# Altium schematic sheet FPGA_Bank_2.SchDoc
size A3
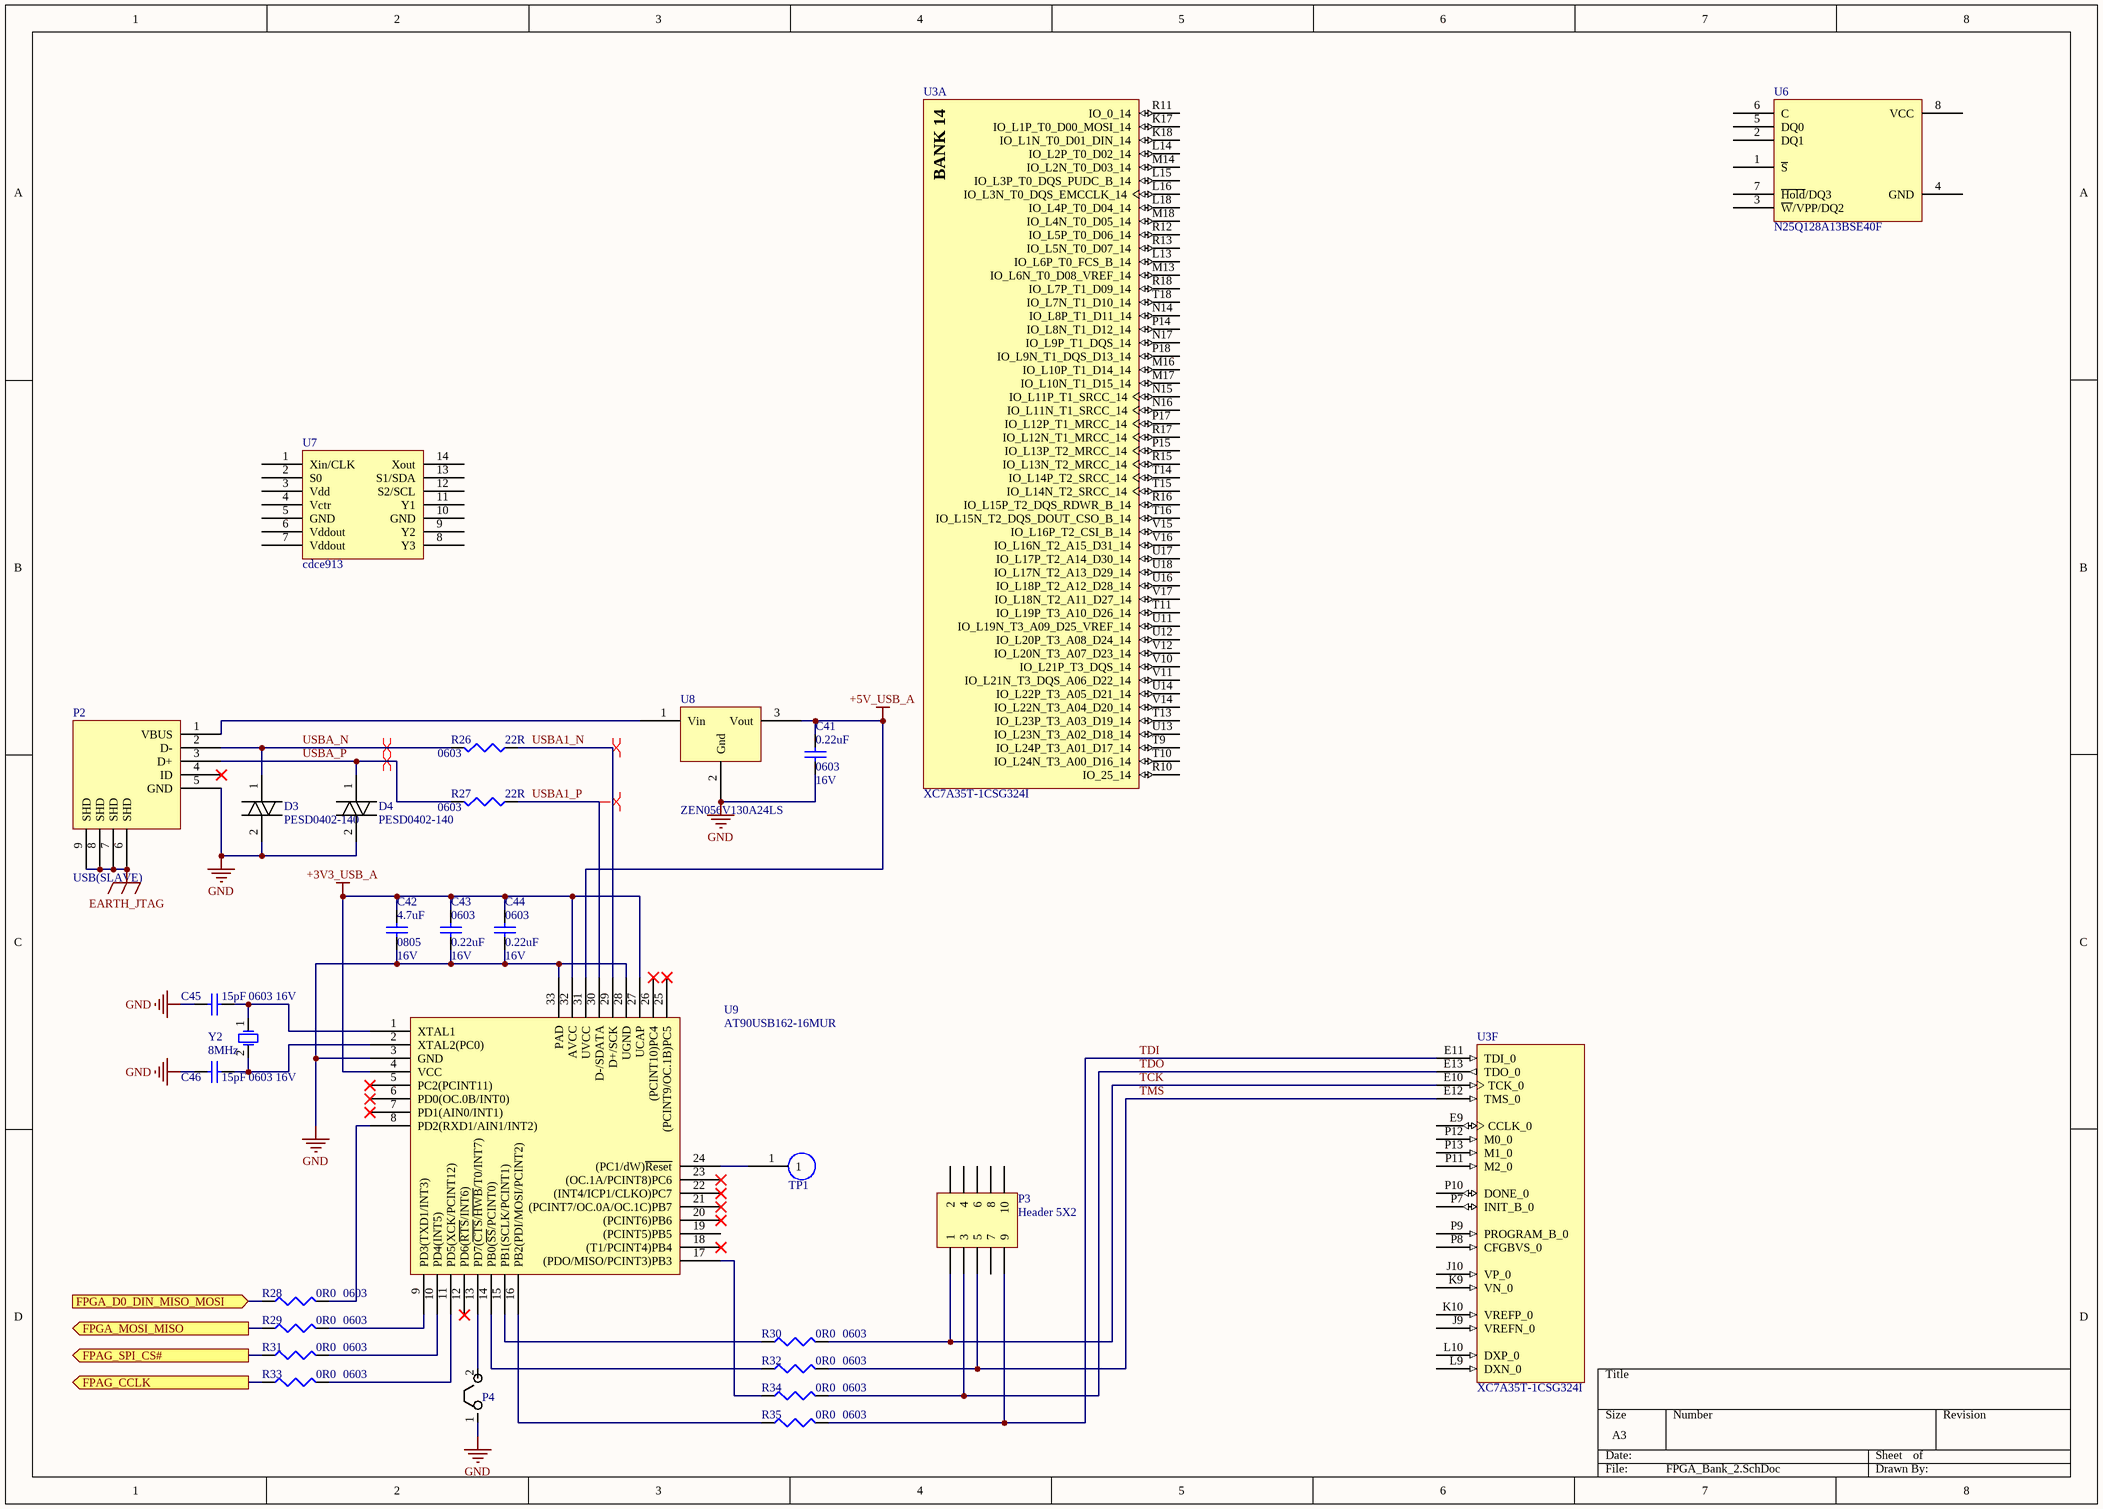
[diagram p0: FPGA_Bank_2.SchDoc]

## Parts
C41  PackageReference: 0603  V: 16V  [1608[0603]]  (hidden comment: 0.22uF)
C42  PackageReference: 0805  V: 16V  [2012[0805]]  (hidden comment: 4.7uF)
C43  PackageReference: 0603  V: 16V  [1608[0603]]  (hidden comment: 0.22uF)
C44  PackageReference: 0603  V: 16V  [1608[0603]]  (hidden comment: 0.22uF)
C45  PackageReference: 0603  V: 16V  [1608[0603]]  (hidden comment: 15pF)
C46  PackageReference: 0603  V: 16V  [1608[0603]]  (hidden comment: 15pF)
D3  PESD0402-140  [PESD0402-140]
D4  PESD0402-140  [PESD0402-140]
P2  USB(SLAVE)  [USB_MINI_Btype]
P3  Header 5X2  [HDR2X5]
P4  DNP  [DNP]  (value not drawn)
R26  value 22R  PackageReference: 0603  [1608[0603]]  (hidden comment: Res3)
R27  value 22R  PackageReference: 0603  [1608[0603]]  (hidden comment: Res3)
R28  value 0R0  PackageReference: 0603  [1608[0603]]  (hidden comment: Res3)
R29  value 0R0  PackageReference: 0603  [1608[0603]]  (hidden comment: Res3)
R30  value 0R0  PackageReference: 0603  [1608[0603]]  (hidden comment: Res3)
R31  value 0R0  PackageReference: 0603  [1608[0603]]  (hidden comment: Res3)
R32  value 0R0  PackageReference: 0603  [1608[0603]]  (hidden comment: Res3)
R33  value 0R0  PackageReference: 0603  [1608[0603]]  (hidden comment: Res3)
R34  value 0R0  PackageReference: 0603  [1608[0603]]  (hidden comment: Res3)
R35  value 0R0  PackageReference: 0603  [1608[0603]]  (hidden comment: Res3)
TP1  TP  (value not drawn)
U3  XC7A35T-1CSG324I  [CSG324]  (parts A,F of 9)
U6  N25Q128A13BSE40F  [N25Q128A13BSE40F[SOP-8]]
U7  cdce913  [CDCE913[TSSOP-14]]
U8  ZEN056V130A24LS  [ZEN056]
U9  AT90USB162-16MUR  [AT90USB162-16MUR]
Y2  8MHz  [XTAL_A]

## Ports
FPAG_CCLK (out), FPAG_SPI_CS# (out), FPGA_D0_DIN_MISO_MOSI (in), FPGA_MOSI_MISO (out)

## Nets
+3V3_USB_A: C42.1 C43.1 C44.1 U9.4(VCC) U9.27(UCAP) U9.32(AVCC)
+5V_USB_A: C41.1 U8.3(Vout) U9.31(UVCC)
EARTH_JTAG: P2.6(SHD) P2.7(SHD) P2.8(SHD) P2.9(SHD)
GND: C41.2 C42.2 C43.2 C44.2 C45.2 C46.2 D3.2 D4.2 P2.5(GND) P4.1 U8.2(Gnd) U9.3(GND) U9.28(UGND) U9.33(PAD)
FPAG_CCLK: R33.1 ; port FPAG_CCLK
FPAG_SPI_CS#: R31.1 ; port FPAG_SPI_CS#
FPGA_D0_DIN_MISO_MOSI: R28.1 ; port FPGA_D0_DIN_MISO_MOSI
FPGA_MOSI_MISO: R29.1 ; port FPGA_MOSI_MISO
TCK: P3.1 R30.2 U3.E10(TCK_0)
TDI: P3.9 R35.2 U3.E11(TDI_0)
TDO: P3.3 R34.2 U3.E13(TDO_0)
TMS: P3.5 R32.2 U3.E12(TMS_0)
USBA1_N: R26.1 U9.29(D+/SCK)
USBA1_P: R27.1 U9.30(D-/SDATA)
USBA_N: D3.1 P2.2(D-) R26.2
USBA_P: D4.1 P2.3(D+) R27.2
NetC45_1: C45.1 U9.1(XTAL1) Y2.1(OSC1)
NetC46_1: C46.1 U9.2(XTAL2(PC0)) Y2.2(OSC2)
NetP2_1: P2.1(VBUS) U8.1(Vin)
NetP4_2: P4.2 U9.13(PD7(~{CTS}/~{HWB}/T0/INT7))
NetR28_2: R28.2 U9.8(PD2(RXD1/AIN1/INT2))
NetR29_2: R29.2 U9.9(PD3(TXD1/INT3))
NetR30_1: R30.1 U9.15(PB1(SCLK/PCINT1))
NetR31_2: R31.2 U9.10(PD4(INT5))
NetR32_1: R32.1 U9.14(PB0(~{SS}/PCINT0))
NetR33_2: R33.2 U9.11(PD5(XCK/PCINT12))
NetR34_1: R34.1 U9.17((PDO/MISO/PCINT3)PB3)
NetR35_1: R35.1 U9.16(PB2(PDI/MOSI/PCINT2))
NetTP1_1: TP1.1 U9.24((PC1/dW)~{Reset})

Not connected (* = marked no-connect by the designer): P2 4(ID)*; P3 2 4 6 7 8 10; U3 E9(CCLK_0) J9(VREFN_0) J10(VP_0) K9(VN_0) K10(VREFP_0) K17(IO_L1P_T0_D00_MOSI_14) K18(IO_L1N_T0_D01_DIN_14) L9(DXN_0) L10(DXP_0) L13(IO_L6P_T0_FCS_B_14) L14(IO_L2P_T0_D02_14) L15(IO_L3P_T0_DQS_PUDC_B_14) L16(IO_L3N_T0_DQS_EMCCLK_14) L18(IO_L4P_T0_D04_14) M13(IO_L6N_T0_D08_VREF_14) M14(IO_L2N_T0_D03_14) M16(IO_L10P_T1_D14_14) M17(IO_L10N_T1_D15_14) M18(IO_L4N_T0_D05_14) N14(IO_L8P_T1_D11_14) N15(IO_L11P_T1_SRCC_14) N16(IO_L11N_T1_SRCC_14) N17(IO_L9P_T1_DQS_14) P7(INIT_B_0) P8(CFGBVS_0) P9(PROGRAM_B_0) P10(DONE_0) P11(M2_0) P12(M0_0) P13(M1_0) P14(IO_L8N_T1_D12_14) P15(IO_L13P_T2_MRCC_14) P17(IO_L12P_T1_MRCC_14) P18(IO_L9N_T1_DQS_D13_14) R10(IO_25_14) R11(IO_0_14) R12(IO_L5P_T0_D06_14) R13(IO_L5N_T0_D07_14) R15(IO_L13N_T2_MRCC_14) R16(IO_L15P_T2_DQS_RDWR_B_14) R17(IO_L12N_T1_MRCC_14) R18(IO_L7P_T1_D09_14) T9(IO_L24P_T3_A01_D17_14) T10(IO_L24N_T3_A00_D16_14) T11(IO_L19P_T3_A10_D26_14) T13(IO_L23P_T3_A03_D19_14) T14(IO_L14P_T2_SRCC_14) T15(IO_L14N_T2_SRCC_14) T16(IO_L15N_T2_DQS_DOUT_CSO_B_14) T18(IO_L7N_T1_D10_14) U11(IO_L19N_T3_A09_D25_VREF_14) U12(IO_L20P_T3_A08_D24_14) U13(IO_L23N_T3_A02_D18_14) U14(IO_L22P_T3_A05_D21_14) U16(IO_L18P_T2_A12_D28_14) U17(IO_L17P_T2_A14_D30_14) U18(IO_L17N_T2_A13_D29_14) V10(IO_L21P_T3_DQS_14) V11(IO_L21N_T3_DQS_A06_D22_14) V12(IO_L20N_T3_A07_D23_14) V14(IO_L22N_T3_A04_D20_14) V15(IO_L16P_T2_CSI_B_14) V16(IO_L16N_T2_A15_D31_14) V17(IO_L18N_T2_A11_D27_14); U6 1(~{S}) 2(DQ1) 3(~{W}/VPP/DQ2) 4(GND) 5(DQ0) 6(C) 7(~{Hold}/DQ3) 8(VCC); U7 1(Xin/CLK) 2(S0) 3(Vdd) 4(Vctr) 5(GND) 6(Vddout) 7(Vddout) 8(Y3) 9(Y2) 10(GND) 11(Y1) 12(S2/SCL) 13(S1/SDA) 14(Xout); U9 5(PC2(PCINT11))* 6(PD0(OC.0B/INT0))* 7(PD1(AIN0/INT1))* 12(PD6(~{RTS}/INT6))* 18((T1/PCINT4)PB4)* 19((PCINT5)PB5) 20((PCINT6)PB6)* 21((PCINT7/OC.0A/OC.1C)PB7)* 22((INT4/ICP1/CLKO)PC7)* 23((OC.1A/PCINT8)PC6)* 25((PCINT9/OC.1B)PC5)* 26((PCINT10)PC4)*

## Layout directives
differential pair: USBA1_N, USBA1_P, USBA_N, USBA_P

## Notes on the sheet
- (in symbol XC7A35T-1CSG324I, part A) BANK 14

## Library data of the parts
C41-C46 = Cap Semi: Capacitor (Semiconductor SIM Model); LatestRevisionDate: 17-Jul-2002; LatestRevisionNote: Re-released for DXP Platform.; Publisher: Altium Limited
  C41 C43 C44: Value: 0.22uF
  C42: Value: 4.7uF
  C45 C46: Value: 15pF
D3 D4 = PESD0402-140: ESD保护器件
P2 = USB(SLAVE): USB座
P3 = Header 5X2: Header, 5-Pin, Dual row; LatestRevisionDate: 17-Jul-2002; LatestRevisionNote: Re-released for DXP Platform.; Publisher: Altium Limited
R26-R35 = Res3: Resistor; Published: 8-Jun-2000; LatestRevisionDate: 29-May-2009; LatestRevisionNote: IPC-7351 Footprint Added.; Publisher: Altium Limited; PackageDescription: Chip Resistor
U3 = XC7A35T-1CSG324I: Artix-7 FPGA, 210 User I/Os, 0 GTP, 324-Ball BGA, Speed Grade 1, Industrial Grade, Pb-Free; Manufacturer: Xilinx; Total Block RAM: 1800 Kb; GTP: 0; Clock Mgmt Tiles (CMTs): 5; Logic Cells: 33280; Available User I/O: 210; Speed Grades: 1; DatasheetVersion: v1.15; PackageVersion: Rev. 1.11; PackageReference: CSG-324; PackageDescription: 324-Ball Wire-Bond Chip-Scale BGA, Body 15 x 15 mm, Pitch 0.8 mm; Maximum Distributed RAM: 400 Kb; Operating Temperature Range: Industrial; NexusDeviceID: XC7A35T-1CSG324I; Mounting Technology: Surface Mount; PartNumber: XC7A35T-1CSG324I; ComponentLink1Description: Manufacturer URL; ComponentLink1URL: http://www.xilinx.com/; ComponentLink2Description: Datasheet; ComponentLink2URL: http://www.xilinx.com/support/documentation/data_sheets/ds180_7Series_Overview.pdf; ComponentLink3Description: Package Specification; ComponentLink3URL: http://www.xilinx.com/support/documentation/user_guides/ug475_7Series_Pkg_Pinout.pdf; ComponentLink4Description: DC and Switching Characteristics; ComponentLink4URL: http://www.xilinx.com/support/documentation/data_sheets/ds181_Artix_7_Data_Sheet.pdf; ComponentLink5Description: Package File; ComponentLink5URL: http://www.xilinx.com/support/packagefiles/a7packages/xc7a200tsbg484pkg.txt; ComponentLink6Description: Packaging and Pinout; ComponentLink6URL: http://www.xilinx.com/support/documentation/user_guides/ug475_7Series_Pkg_Pinout.pdf
U6 = N25Q128A13BSE40F: 128Mb, 3V, Multiple I/O Serial Flash Memory; MANF: Micron; Preferred Part Number: N25Q128A13BSE40F; Value: N25Q128A13BSE40F
U7 = cdce913: Flexible Low Power LVCMOS Clock Generator With SSC Support for EMI Reduction; MANF: TI; Preferred Part Number: cdce913; Value: cdce913
U8 = ZEN056V130A24LS: 电压瞬态抑制器
Y2 = XTAL: Crystal Oscillator; Published: 8-Jun-2000; LatestRevisionDate: 17-Jul-2002; LatestRevisionNote: Re-released for DXP Platform.; PackageReference: R38; Publisher: Altium Limited; Value: 8MHz